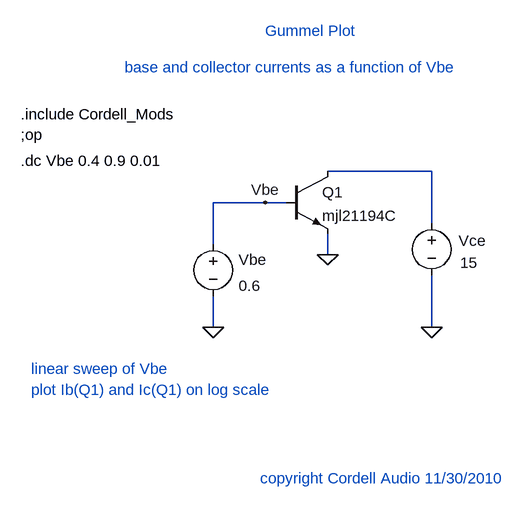
[diagram p0: schematic Gummel Plot.asc]
Gummel Plot.asc, the LTspice schematic file:
Version 4
SHEET 1 880 744
WIRE 160 256 0 256
WIRE -96 304 -176 304
WIRE -64 304 -96 304
WIRE 160 336 160 256
WIRE -176 368 -176 304
WIRE 0 384 0 352
WIRE -176 496 -176 448
WIRE 160 496 160 416
FLAG 160 496 0
FLAG -176 496 0
FLAG -96 304 Vbe
FLAG 0 384 0
SYMBOL voltage 160 320 R0
WINDOW 123 0 0 Left 0
WINDOW 39 0 0 Left 0
WINDOW 0 42 43 Left 0
WINDOW 3 44 77 Left 0
SYMATTR InstName Vce
SYMATTR Value 15
SYMBOL npn -64 256 R0
SYMATTR InstName Q1
SYMATTR Value mjl21194C
SYMBOL voltage -176 352 R0
WINDOW 123 0 0 Left 0
WINDOW 39 0 0 Left 0
WINDOW 0 39 40 Left 0
WINDOW 3 39 80 Left 0
SYMATTR InstName Vbe
SYMATTR Value 0.6
TEXT -472 200 Left 0 !;op
TEXT -96 40 Left 0 ;Gummel Plot
TEXT -472 240 Left 0 !.dc Vbe 0.4 0.9 0.01
TEXT -472 168 Left 0 !.include Cordell_Mods
TEXT -456 560 Left 0 ;linear sweep of Vbe
TEXT -456 592 Left 0 ;plot Ib(Q1) and Ic(Q1) on log scale
TEXT -312 96 Left 0 ;base and collector currents as a function of Vbe
TEXT -104 728 Left 0 ;copyright Cordell Audio 11/30/2010

The netlist it stands for:
* Gummel Plot.asc
Vce N001 0 15
Q1 N001 Vbe 0 0 mjl21194C
Vbe Vbe 0 0.6
.model NPN NPN
.model PNP PNP
.lib standard.bjt
;op
* Gummel Plot
.dc Vbe 0.4 0.9 0.01
.include Cordell_Mods
* linear sweep of Vbe
* plot Ib(Q1) and Ic(Q1) on log scale
* base and collector currents as a function of Vbe
* copyright Cordell Audio 11/30/2010
.backanno
.end